# EAGLE design FAL65816_Videoa (EAGLE 8.7.1)
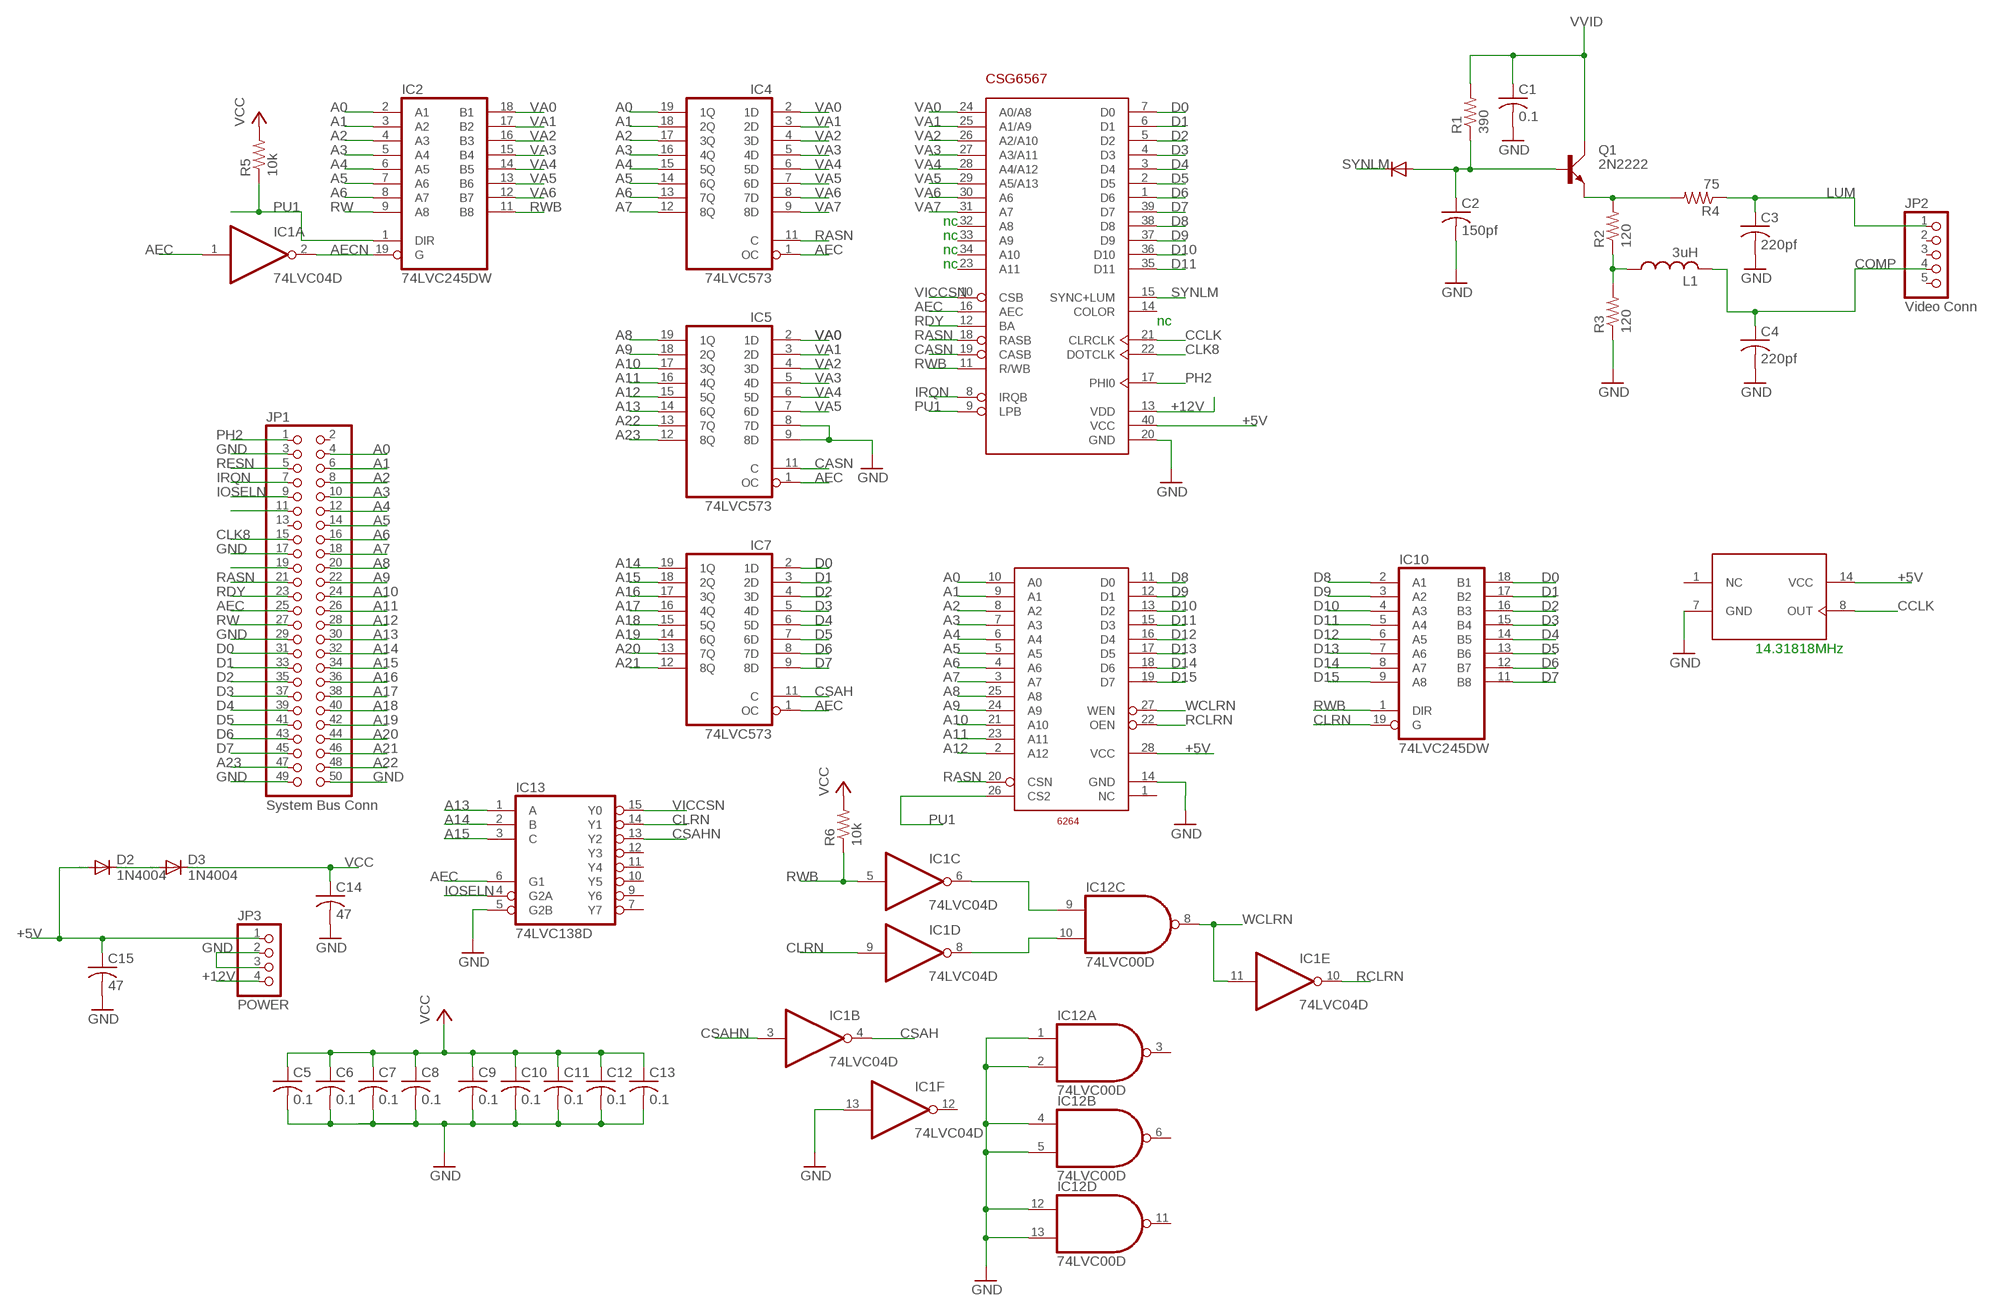
[diagram p0: schematic, sheet 1]

## Parts
C1  0.1  C-US050-024X044  [C050-024X044]
C2  150pf  C-US050-024X044  [C050-024X044]
C3  220pf  C-US050-024X044  [C050-024X044]
C4  220pf  C-US050-024X044  [C050-024X044]
C5  0.1  C-US050-024X044  [C050-024X044]
C6  0.1  C-US050-024X044  [C050-024X044]
C7  0.1  C-US050-024X044  [C050-024X044]
C8  0.1  C-US050-024X044  [C050-024X044]
C9  0.1  C-US050-024X044  [C050-024X044]
C10  0.1  C-US050-024X044  [C050-024X044]
C11  0.1  C-US050-024X044  [C050-024X044]
C12  0.1  C-US050-024X044  [C050-024X044]
C13  0.1  C-US050-024X044  [C050-024X044]
C14  47  C-US050-024X044  [C050-024X044]
C15  47  C-US050-024X044  [C050-024X044]
D2  1N4004  [DO41-10]
D3  1N4004  [DO41-10]
IC1  74LVC04D  74LS04D  [SO14]
IC2  74LVC245DW  74LS245DW  [SO20W]
IC4  74LVC573  [SO20W]
IC5  74LVC573  [SO20W]
IC7  74LVC573  [SO20W]
IC10  74LVC245DW  74LS245DW  [SO20W]
IC12  74LVC00D  74LS00D  [SO14]
IC13  74LVC138D  74LS138D  [SO16]
JP1  System Bus Conn  PINHD-2X25/90  [2X25/90]
JP2  Video Conn  PINHD-1X5  [1X05]
JP3  POWER  PINHD-1X4/90  [1X04/90]
L1  3uH  L-US0204/7  [0204/7]
Q1  2N2222  [TO18A]
R1  390  R-US_0204/7  [0204/7]
R2  120  R-US_0204/7  [0204/7]
R3  120  R-US_0204/7  [0204/7]
R4  75  R-US_0204/7  [0204/7]
R5  10k  R-US_0204/7  [0204/7]
R6  10k  R-US_0204/7  [0204/7]
U$1  CSG6567  [DIP-40]
U$3  OSC14  [DIL14]
U$4  6264  [DIL28-6]

## Nets
+5V: C15.1 D2.A JP3.1 U$1.40(VCC) U$3.14(VCC) U$4.28(VCC)
+12V: JP3.4 U$1.13(VDD)
A0: IC2.2(A1) IC4.19(1Q) JP1.4 U$4.10(A0)
A1: IC2.3(A2) IC4.18(2Q) JP1.6 U$4.9(A1)
A2: IC2.4(A3) IC4.17(3Q) JP1.8 U$4.8(A2)
A3: IC2.5(A4) IC4.16(4Q) JP1.10 U$4.7(A3)
A4: IC2.6(A5) IC4.15(5Q) JP1.12 U$4.6(A4)
A5: IC2.7(A6) IC4.14(6Q) JP1.14 U$4.5(A5)
A6: IC2.8(A7) IC4.13(7Q) JP1.16 U$4.4(A6)
A7: IC4.12(8Q) JP1.18 U$4.3(A7)
A8: IC5.19(1Q) JP1.20 U$4.25(A8)
A9: IC5.18(2Q) JP1.22 U$4.24(A9)
A10: IC5.17(3Q) JP1.24 U$4.21(A10)
A11: IC5.16(4Q) JP1.26 U$4.23(A11)
A12: IC5.15(5Q) JP1.28 U$4.2(A12)
A13: IC5.14(6Q) IC13.1(A) JP1.30
A14: IC7.19(1Q) IC13.2(B) JP1.32
A15: IC7.18(2Q) IC13.3(C) JP1.34
A16: IC7.17(3Q) JP1.36
A17: IC7.16(4Q) JP1.38
A18: IC7.15(5Q) JP1.40
A19: IC7.14(6Q) JP1.42
A20: IC7.13(7Q) JP1.44
A21: IC7.12(8Q) JP1.46
A22: IC5.13(7Q) JP1.48
A23: IC5.12(8Q) JP1.47
AEC: IC1.1(A:I) IC4.1(OC) IC5.1(OC) IC7.1(OC) IC13.6(G1) JP1.25 U$1.16(AEC)
AECN: IC1.2(A:O) IC2.19(G)
CASN: IC5.11(C) U$1.19(CASB)
CCLK: U$1.21(CLRCLK) U$3.8(OUT)
CLK8: JP1.15 U$1.22(DOTCLK)
CLRN: IC1.9(D:I) IC10.19(G) IC13.14(Y1)
COMP: C4.1 JP2.4 L1.2
CSAH: IC1.4(B:O) IC7.11(C)
CSAHN: IC1.3(B:I) IC13.13(Y2)
D0: IC7.2(1D) IC10.18(B1) JP1.31 U$1.7(D0)
D1: IC7.3(2D) IC10.17(B2) JP1.33 U$1.6(D1)
D2: IC7.4(3D) IC10.16(B3) JP1.35 U$1.5(D2)
D3: IC7.5(4D) IC10.15(B4) JP1.37 U$1.4(D3)
D4: IC7.6(5D) IC10.14(B5) JP1.39 U$1.3(D4)
D5: IC7.7(6D) IC10.13(B6) JP1.41 U$1.2(D5)
D6: IC7.8(7D) IC10.12(B7) JP1.43 U$1.1(D6)
D7: IC7.9(8D) IC10.11(B8) JP1.45 U$1.39(D7)
D8: IC10.2(A1) U$1.38(D8) U$4.11(D0)
D9: IC10.3(A2) U$1.37(D9) U$4.12(D1)
D10: IC10.4(A3) U$1.36(D10) U$4.13(D2)
D11: IC10.5(A4) U$1.35(D11) U$4.15(D3)
D12: IC10.6(A5) U$4.16(D4)
D13: IC10.7(A6) U$4.17(D5)
D14: IC10.8(A7) U$4.18(D6)
D15: IC10.9(A8) U$4.19(D7)
GND: C1.2 C2.2 C3.2 C4.2 C5.2 C6.2 C7.2 C8.2 C9.2 C10.2 C11.2 C12.2 C13.2 C14.2 C15.2 IC1.13(F:I) IC5.8(7D) IC5.9(8D) IC12.1(A:I0) IC12.2(A:I1) IC12.4(B:I0) IC12.5(B:I1) IC12.12(D:I0) IC12.13(D:I1) IC13.5(G2B) JP1.3 JP1.17 JP1.29 JP1.49 JP1.50 JP3.2 JP3.3 R3.1 U$1.20(GND) U$3.7(GND) U$4.14(GND)
IOSELN: IC13.4(G2A) JP1.9
IRQN: JP1.7 U$1.8(IRQB)
LUM: C3.1 JP2.1 R4.1
N$2: D2.C D3.A
N$5: IC1.6(C:O) IC12.9(C:I0)
N$6: IC1.8(D:O) IC12.10(C:I1)
N$10: JP1.19
N$15: C2.1 Q1.B R1.1
N$17: L1.1 R2.1 R3.2
N$18: Q1.E R2.2 R4.2
N$40: JP1.11
PH2: JP1.1 U$1.17(PHI0)
PU1: IC2.1(DIR) R5.1 U$1.9(LPB) U$4.26(CS2)
RASN: IC4.11(C) JP1.21 U$1.18(RASB) U$4.20(CSN)
RCLRN: IC1.10(E:O) U$4.22(OEN)
RDY: JP1.23 U$1.12(BA)
RESN: JP1.5
RW: IC2.9(A8) JP1.27
RWB: IC1.5(C:I) IC2.11(B8) IC10.1(DIR) R6.1 U$1.11(R/WB)
SYNLM: U$1.15(SYNC+LUM)
VA0: IC2.18(B1) IC4.2(1D) IC5.2(1D) U$1.24(A0/A8)
VA1: IC2.17(B2) IC4.3(2D) IC5.3(2D) U$1.25(A1/A9)
VA2: IC2.16(B3) IC4.4(3D) IC5.4(3D) U$1.26(A2/A10)
VA3: IC2.15(B4) IC4.5(4D) IC5.5(4D) U$1.27(A3/A11)
VA4: IC2.14(B5) IC4.6(5D) IC5.6(5D) U$1.28(A4/A12)
VA5: IC2.13(B6) IC4.7(6D) IC5.7(6D) U$1.29(A5/A13)
VA6: IC2.12(B7) IC4.8(7D) U$1.30(A6)
VA7: IC4.9(8D) U$1.31(A7)
VCC: C5.1 C6.1 C7.1 C8.1 C9.1 C10.1 C11.1 C12.1 C13.1 C14.1 D3.C R5.2 R6.2
VICCSN: IC13.15(Y0) U$1.10(CSB)
VVID: C1.1 Q1.C R1.2
WCLRN: IC1.11(E:I) IC12.8(C:O) U$4.27(WEN)
Unconnected: IC1.12(F:O) IC12.3(A:O) IC12.6(B:O) IC12.11(D:O) IC13.7(Y7) IC13.9(Y6) IC13.10(Y5) IC13.11(Y4) IC13.12(Y3) JP1.2 JP1.13 JP2.2 JP2.3 JP2.5 U$1.14(COLOR) U$1.23(A11) U$1.32(A8) U$1.33(A9) U$1.34(A10) U$3.1(NC) U$4.1(NC)

## Notes on the sheet
- nc
- nc
- nc
- nc
- nc
- 14.31818MHz

## Power pins joined to a net without a drawn wire
GND: IC1.7(P:GND) IC2.10(GND) IC4.10(GND) IC5.10(GND) IC7.10(GND) IC10.10(GND) IC12.7(P:GND) IC13.8(GND)
VCC: IC1.14(P:VCC) IC2.20(VCC) IC4.20(VCC) IC5.20(VCC) IC7.20(VCC) IC10.20(VCC) IC12.14(P:VCC) IC13.16(VCC)

## Library data of the parts
C1 C3 C4 = resistor:C-US: CAPACITOR, American symbol
C2 C5-C15 = rcl:C-US: CAPACITOR, American symbol
D2 D3 = diode:1N4004: DIODE general purpose rectifier, 1 A
IC1 = 74xx-us:74*04: Hex INVERTER
IC2 = FT74xx:74*245: Octal BUS TRANSCEIVER, 3-state
IC4 IC5 IC7 = FT74xx:74*573: 8-bit D latch BUS DRIVER
IC10 = 74xx-us:74*245: Octal BUS TRANSCEIVER, 3-state
IC12 = 74xx-us:74*00: Quad 2-input NAND gate
IC13 = FT74xx:74*138: 3-line to 8-line DECODER/DEMULTIPLEXER
JP1 = pinhead:PINHD-2X25: PIN HEADER
JP2 = pinhead:PINHD-1X5: PIN HEADER
JP3 = pinhead:PINHD-1X4: PIN HEADER
L1 = resistor:L-US: INDUCTOR, American symbol
Q1 = transistor-small-signal:2N2222: NPN TRANSISTOR
R1-R6 = resistor:R-US_: RESISTOR, American symbol
U$1 = 65xxx:CSG6567
U$3 = FT74xx:OSC14
U$4 = FT74xx:6264: 8kx8 Static RAM

## Board
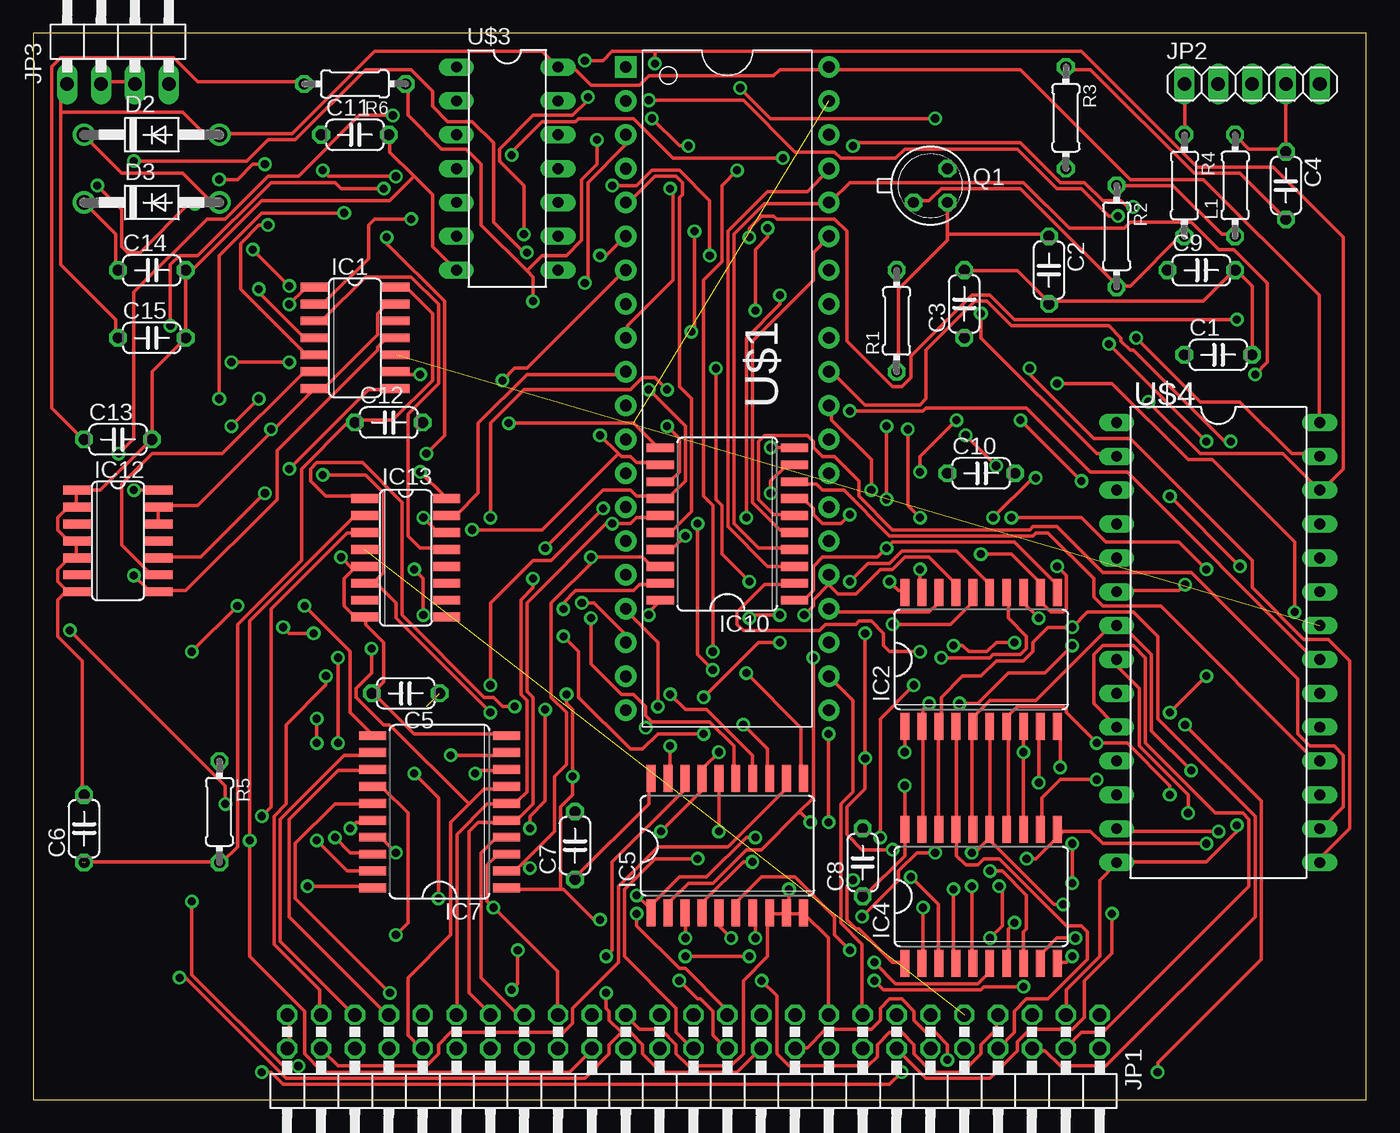
[diagram p1: board, top side]
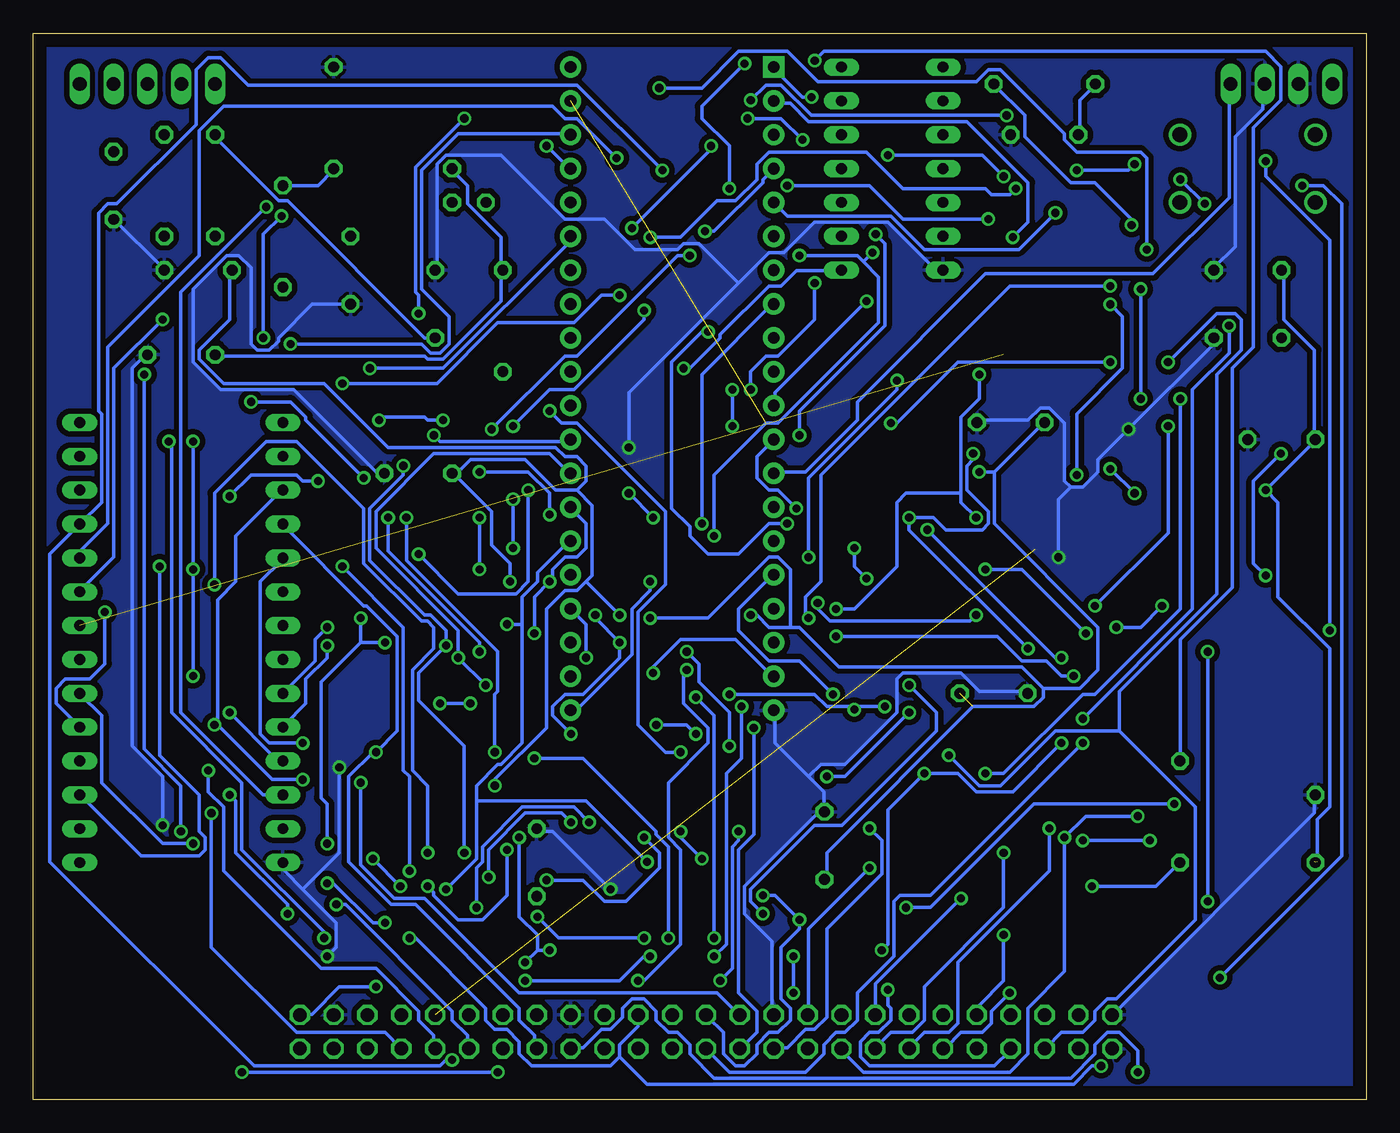
[diagram p2: board, bottom side, seen from below]

Size 100 x 80 mm. Coordinates in mm from the lower left corner, seen from the top.
Outline: 0,0 100,0 100,80 0,80 0,0
Copper layers (1*16): Top 0.035mm / dielectric 1.5mm / Bottom 0.035mm
Design rules "default": minimum track width 10mil, minimum drill 24mil, track to track 8mil, track to pad 8mil, pad to pad 8mil, via to via 8mil, smd to smd 8mil, copper to edge 40mil, drill to drill 8mil, minimum pad ring 10mil, minimum via ring 8mil, stop-mask expansion 4mil, vias tented up to drill 0mil, thermal gap 10mil

### Footprints (pad centres in the part's own frame; a part is rotated, then mirrored left to right if it is on the bottom)
C050-024X044 = drill 0.813 octagon: 1 -2.54,0; 2 2.54,0
DO41-10 = drill 1.118: A 5.08,0; C -5.08,0
SO14 = smd 0.66 x 2.032: 1 -3.81,-3.073; 2 -2.54,-3.073; 3 -1.27,-3.073; 4 0,-3.073; 5 1.27,-3.073; 6 2.54,-3.073; 7 3.81,-3.073; 8 3.81,3.073; 9 2.54,3.073; 10 1.27,3.073; 11 0,3.073; 12 -1.27,3.073; 13 -2.54,3.073; 14 -3.81,3.073
SO20W = smd 0.66 x 2.032: 1 -5.715,-5.029; 2 -4.445,-5.029; 3 -3.175,-5.029; 4 -1.905,-5.029; 5 -0.635,-5.029; 6 0.635,-5.029; 7 1.905,-5.029; 8 3.175,-5.029; 9 4.445,-5.029; 10 5.715,-5.029; 11 5.715,5.029; 12 4.445,5.029; 13 3.175,5.029; 14 1.905,5.029; 15 0.635,5.029; 16 -0.635,5.029; 17 -1.905,5.029; 18 -3.175,5.029; 19 -4.445,5.029; 20 -5.715,5.029
SO16 = smd 0.66 x 2.032: 1 -4.445,-3.073; 2 -3.175,-3.073; 3 -1.905,-3.073; 4 -0.635,-3.073; 5 0.635,-3.073; 6 1.905,-3.073; 7 3.175,-3.073; 8 4.445,-3.073; 9 4.445,3.073; 10 3.175,3.073; 11 1.905,3.073; 12 0.635,3.073; 13 -0.635,3.073; 14 -1.905,3.073; 15 -3.175,3.073; 16 -4.445,3.073
2X25/90 = drill 1.016 octagon: 1 -29.21,-6.35; 2 -29.21,-3.81; 3 -26.67,-6.35; 4 -26.67,-3.81; 5 -24.13,-6.35; 6 -24.13,-3.81; 7 -21.59,-6.35; 8 -21.59,-3.81; 9 -19.05,-6.35; 10 -19.05,-3.81; 11 -16.51,-6.35; 12 -16.51,-3.81; 13 -13.97,-6.35; 14 -13.97,-3.81; 15 -11.43,-6.35; 16 -11.43,-3.81; 17 -8.89,-6.35; 18 -8.89,-3.81; 19 -6.35,-6.35; 20 -6.35,-3.81; 21 -3.81,-6.35; 22 -3.81,-3.81; 23 -1.27,-6.35; 24 -1.27,-3.81; 25 1.27,-6.35; 26 1.27,-3.81; 27 3.81,-6.35; 28 3.81,-3.81; 29 6.35,-6.35; 30 6.35,-3.81; 31 8.89,-6.35; 32 8.89,-3.81; 33 11.43,-6.35; 34 11.43,-3.81; 35 13.97,-6.35; 36 13.97,-3.81; 37 16.51,-6.35; 38 16.51,-3.81; 39 19.05,-6.35; 40 19.05,-3.81; 41 21.59,-3.81; 42 21.59,-6.35; 43 24.13,-3.81; 44 24.13,-6.35; 45 26.67,-3.81; 46 26.67,-6.35; 47 29.21,-3.81; 48 29.21,-6.35; 49 31.75,-3.81; 50 31.75,-6.35
1X05 = drill 1.016 long: 1 -5.08,0; 2 -2.54,0; 3 0,0; 4 2.54,0; 5 5.08,0
1X04/90 = drill 1.016 long: 1 -3.81,-3.81; 2 -1.27,-3.81; 3 1.27,-3.81; 4 3.81,-3.81
0204/7 = drill 0.813 octagon: 1 -3.81,0; 2 3.81,0
TO18A = drill 0.813 octagon: B 1.27,-1.27; C 1.27,1.27; E -1.27,-1.27
DIP-40 = drill 0.889 pad 1.6 square: 1 -22.86,-7.62 | drill 0.889 pad 1.6: 2 -20.32,-7.62; 3 -17.78,-7.62; 4 -15.24,-7.62; 5 -12.7,-7.62; 6 -10.16,-7.62; 7 -7.62,-7.62; 8 -5.08,-7.62; 9 -2.54,-7.62; 10 0,-7.62; 11 2.54,-7.62; 12 5.08,-7.62; 13 7.62,-7.62; 14 10.16,-7.62; 15 12.7,-7.62; 16 15.24,-7.62; 17 17.78,-7.62; 18 20.32,-7.62; 19 22.86,-7.62; 20 25.4,-7.62; 21 25.4,7.62; 22 22.86,7.62; 23 20.32,7.62; 24 17.78,7.62; 25 15.24,7.62; 26 12.7,7.62; 27 10.16,7.62; 28 7.62,7.62; 29 5.08,7.62; 30 2.54,7.62; 31 0,7.62; 32 -2.54,7.62; 33 -5.08,7.62; 34 -7.62,7.62; 35 -10.16,7.62; 36 -12.7,7.62; 37 -15.24,7.62; 38 -17.78,7.62; 39 -20.32,7.62; 40 -22.86,7.62
DIL14 = drill 0.813 long: 1 -7.62,-3.81; 2 -5.08,-3.81; 3 -2.54,-3.81; 4 0,-3.81; 5 2.54,-3.81; 6 5.08,-3.81; 7 7.62,-3.81; 8 7.62,3.81; 9 5.08,3.81; 10 2.54,3.81; 11 0,3.81; 12 -2.54,3.81; 13 -5.08,3.81; 14 -7.62,3.81
DIL28-6 = drill 0.813 long: 1 -16.51,-7.62; 2 -13.97,-7.62; 3 -11.43,-7.62; 4 -8.89,-7.62; 5 -6.35,-7.62; 6 -3.81,-7.62; 7 -1.27,-7.62; 8 1.27,-7.62; 9 3.81,-7.62; 10 6.35,-7.62; 11 8.89,-7.62; 12 11.43,-7.62; 13 13.97,-7.62; 14 16.51,-7.62; 15 16.51,7.62; 16 13.97,7.62; 17 11.43,7.62; 18 8.89,7.62; 19 6.35,7.62; 20 3.81,7.62; 21 1.27,7.62; 22 -1.27,7.62; 23 -3.81,7.62; 24 -6.35,7.62; 25 -8.89,7.62; 26 -11.43,7.62; 27 -13.97,7.62; 28 -16.51,7.62

### Placement (x,y rotation side)
C1  88.9,55.88 0 top
C2  76.2,62.23 270 top
C3  69.85,59.69 90 top
C4  93.98,68.58 270 top
C5  27.94,30.48 180 top
C6  3.81,20.32 90 top
C7  40.64,19.05 90 top
C8  62.23,17.78 90 top
C9  87.63,62.23 0 top
C10  71.12,46.99 0 top
C11  24.13,72.39 0 top
C12  26.67,50.8 0 top
C13  6.35,49.53 0 top
C14  8.89,62.23 0 top
C15  8.89,57.15 0 top
D2  8.89,72.39 0 top
D3  8.89,67.31 0 top
IC1  24.13,57.15 270 top
IC2  71.12,33.02 0 top
IC4  71.12,15.24 0 top
IC5  52.07,19.05 0 top
IC7  30.48,21.59 90 top
IC10  52.07,43.18 90 top
IC12  6.35,41.91 270 top
IC13  27.94,40.64 270 top
JP1  50.8,0 180 top
JP2  91.44,76.2 0 top
JP3  6.35,80.01 0 top
L1  90.17,68.58 90 top
Q1  67.31,68.58 0 top
R1  64.77,58.42 90 top
R2  81.28,64.77 270 top
R3  77.47,73.66 270 top
R4  86.36,68.58 270 top
R5  13.97,21.59 270 top
R6  24.13,76.2 180 top
U$1  52.07,54.61 270 top
U$3  35.56,69.85 270 top
U$4  88.9,34.29 270 top

### Tracks (layer width: path | path; a pad name or v marks a point on that pad's centre or on a via)
+5V
  Top 0.254: 2.06,74.07 2.06,75.67 2.52,76.12 JP3.1 | 2.06,74.07 2.06,62.64 6.17,58.52 6.17,57.15 C15.1 | 2.06,74.07 11.2,74.07 12.8,72.47 13.95,72.47 D2.A 14.17,72.47 19.43,72.47 25.6,78.64 38.18,78.64 39.32,77.5 U$3.14 39.55,77.27 40.69,77.27 41.83,76.12 45.49,76.12 46.18,76.81 55.55,76.81 56.01,77.27 59.66,77.27 U$1.40 59.89,77.27 74.07,77.27 82.3,69.04 87.78,69.04 96.47,60.35 96.47,50.98 U$4.28
+12V
  Bottom 0.254: JP3.4 10.29,76.12 10.29,67.67 16,61.95 28.57,61.95 38.18,52.35 38.18,50.98 42.06,47.09 44.35,47.09 U$1.13
A0  (via drill 0.61)
  Top 0.254: IC4.19 66.75,20.34 66.75,27.89 IC2.2 66.75,28.12 66.75,29.26 v67.21,29.72 | U$4.10 81.15,28.12 79.55,29.72 79.55,33.38 80.24,34.06 82.53,34.06 83.44,33.15 83.44,26.75 88.7,21.49 90.75,21.49 91.21,21.03 91.21,16 80.24,5.03 78.64,5.03 77.5,3.89 JP1.4 | v69.49,29.72 70.87,29.72 73.15,32 75.89,32 v77.95,34.06
  Bottom 0.254: v69.49,29.72 v67.21,29.72 | v77.95,34.06 77.95,33.15 79.55,31.55 79.55,29.72 81.15,28.12 U$4.10
A1  (via drill 0.61)
  Top 0.254: IC4.18 67.89,20.34 67.89,27.89 IC2.3 68.12,28.12 68.12,30.18 69.72,31.77 71.09,31.77 72.24,32.92 74.3,32.92 74.98,33.6 74.98,34.29 76.12,35.43 v77.95,35.43 79.1,36.58 82.53,36.58 84.35,34.75 84.35,28.57 91.67,21.26 91.67,13.72 80.47,2.52 77.04,2.52 75.89,3.66 74.98,3.66 JP1.6
  Bottom 0.254: v77.95,35.43 78.87,34.52 78.87,32.92 81.15,30.63 U$4.9
A2  (via drill 0.61)
  Top 0.254: IC2.4 69.27,27.89 69.27,20.34 IC4.17 69.27,20.12 69.27,18.29 69.95,17.6 70.87,17.6 71.32,18.06 72.47,18.06 77.5,13.03 78.64,13.03 79.1,12.57 79.1,10.52 76.12,7.54 74.52,7.54 73.61,6.63 73.61,5.03 JP1.8 | v86.64,21.49 86.64,22.86 82.98,26.52 82.98,30.86 81.38,32.46 81.38,32.92 U$4.8
  Bottom 0.254: v86.64,21.49 86.64,11.43 80.24,5.03 73.61,5.03 JP1.8
A3  (via drill 0.61)
  Top 0.254: IC4.16 70.41,20.34 70.41,27.89 IC2.5 70.64,28.12 70.64,28.8 71.78,29.95 75.21,29.95 80.7,35.43 81.15,35.43 U$4.7 81.38,35.43 81.84,35.43 83.9,33.38 83.9,27.66 v86.87,24.69
  Bottom 0.254: v86.87,24.69 86.87,23.09 85.72,21.95 85.72,17.14 78.41,9.83 74.3,9.83 71.09,6.63 71.09,5.94 69.95,4.8 69.95,3.89 JP1.10
A4  (via drill 0.61)
  Top 0.254: IC4.15 71.78,20.34 71.78,27.89 IC2.6 | v86.41,38.63 85.95,38.18 81.38,38.18 U$4.6 | v70.41,18.52 70.64,18.52 71.55,19.43 71.55,19.66 | 71.55,19.66 71.55,20.12 IC4.15 | v77.27,14.63 76.58,14.63 71.55,19.66 | 71.55,19.66 IC4.15
  Bottom 0.254: v86.41,38.63 86.41,45.49 82.53,49.38 80.24,49.38 75.21,44.35 75.21,40.23 70.87,35.89 70.41,35.89 69.95,35.43 69.95,33.83 71.55,32.23 71.55,24.69 70.41,23.55 v70.41,18.52 | v77.27,14.63 76.58,14.63 68.58,6.63 68.58,5.94 67.44,4.8 67.44,3.89 JP1.12
A5  (via drill 0.61)
  Top 0.254: IC4.14 73.15,20.34 73.15,27.89 IC2.7 73.15,28.12 73.15,28.8 73.84,29.49 77.27,29.49 77.5,29.26 77.5,29.03 v79.78,26.75 82.07,26.75 85.27,23.55 v85.27,22.86 | JP1.14 66.98,1.6 71.78,1.6 73.84,3.66 73.84,4.34 74.75,5.26 77.95,5.26 78.87,6.17 78.87,8.91 80.92,10.97 v80.92,13.95
  Bottom 0.254: v79.78,26.75 82.3,26.75 82.98,27.43 82.98,38.86 81.38,40.46 U$4.5 | v80.92,13.95 80.92,14.63 84.81,18.52 84.81,22.4 v85.27,22.86
A6  (via drill 0.61)
  Top 0.254: IC2.8 v74.3,26.06 IC4.13
  Bottom 0.254: U$4.4 81.15,42.98 75.21,37.03 74.98,37.03 72.69,34.75 72.69,27.66 v74.3,26.06 74.52,26.06 76.35,24.23 76.35,17.83 73.15,14.63 71.32,14.63 63.55,6.86 63.55,5.94 62.41,4.8 62.41,3.89 JP1.16
A7  (via drill 0.61)
  Top 0.254: v79.78,24 77.04,24 75.67,22.63 75.67,20.34 IC4.12 | v17.14,2.06 17.83,2.06 18.75,1.14 64.24,1.14 v65.15,2.06 | v84.35,2.06 84.35,2.74 92.13,10.52 92.13,22.4 v86.41,28.12
  Bottom 0.254: v79.78,24 82.07,24 86.18,28.12 | 86.18,28.12 86.18,37.49 84.81,38.86 84.81,42.29 81.38,45.72 U$4.3 | v17.14,2.06 17.14,3.66 18.52,5.03 19.43,5.03 20.34,4.12 20.34,3.43 22.17,1.6 48.92,1.6 50.75,3.43 50.75,4.12 51.66,5.03 52.35,5.03 53.26,5.94 53.26,6.63 54.18,7.54 55.09,7.54 55.78,6.86 55.78,6.17 56.69,5.26 57.38,5.26 58.75,3.89 59.66,3.89 JP1.18 | v84.35,2.06 v65.15,2.06 | 86.18,28.12 v86.41,28.12
A8  (via drill 0.61)
  Top 0.254: v47.78,26.52 47.78,24.23 IC5.19 | v50.98,33.6 50.98,44.58 50.29,45.26 50.29,61.49 51.66,62.87 51.66,68.58 v52.81,69.72 | v68.58,2.97 68.58,4.12 67.67,5.03 66.98,5.03 66.06,5.94 66.06,6.63 65.15,7.54 64.24,7.54 63.55,6.86 63.55,5.94 62.87,5.26 59.44,5.26 58.06,3.89 57.15,3.89 JP1.20
  Bottom 0.254: v47.78,26.52 47.78,29.03 50.06,31.32 50.06,32.69 v50.98,33.6 | v52.81,69.72 59.21,76.12 83.9,76.12 85.95,78.18 86.87,78.18 87.78,77.27 87.78,73.15 93.73,67.21 94.41,67.21 95.1,66.52 95.1,51.66 94.87,51.44 94.87,44.81 96.47,43.2 U$4.25 96.7,42.98 98.75,40.92 98.75,17.83 83.44,2.52 69.49,2.52 69.04,2.97 v68.58,2.97
A9  (via drill 0.61)
  Top 0.254: v42.98,10.74 43.43,11.2 43.43,17.83 48.69,23.09 48.69,24 IC5.18 | v42.98,8 42.98,6.86 43.2,6.63 43.2,5.94 44.12,5.03 | 44.12,5.03 44.81,5.03 45.72,4.12 45.72,3.43 47.09,2.06 52.81,2.06 54.41,3.66 JP1.22 | v56.24,70.64 48.01,70.64 45.03,73.61 40.92,73.61 40.69,73.38 38.18,73.38 35.89,71.09 v35.89,70.87 | v27.2,69.27 22.17,69.27 v21.72,69.72 | v17.37,70.18 16.46,70.18 15.32,69.04 v13.95,69.04 | v12.12,67.21 11.66,67.21 8,63.55 7.09,63.55 6.63,64.01 6.63,66.75 v4.8,68.58 | v10.97,9.14 11.43,9.14 18.97,1.6 41.38,1.6 43.2,3.43 43.2,4.12 44.12,5.03
  Bottom 0.254: v42.98,8 v42.98,10.74 | v56.24,70.64 59.21,73.61 60.12,73.61 61.04,74.52 85.72,74.52 87.55,72.69 87.55,63.32 94.41,56.46 94.41,43.2 96.47,41.15 96.47,40.69 U$4.24 | v35.89,70.87 28.8,70.87 v27.2,69.27 | v21.72,69.72 17.83,69.72 v17.37,70.18 | v12.12,67.21 v13.95,69.04 | v4.8,68.58 3.2,68.58 1.83,67.21 1.83,18.29 v10.97,9.14
A10  (via drill 0.61)
  Top 0.254: v47.09,20.12 50.06,23.09 50.06,24 IC5.17 50.29,24.23 50.29,24.92 v51.44,26.06 | v48.46,8.91 49.84,7.54 50.06,7.54 50.98,6.63 50.98,4.8 51.89,3.89 JP1.24 | v61.27,51.66 66.75,51.66 66.98,51.89 74.52,51.89 79.32,47.09 82.07,47.09 96.01,33.15 96.47,33.15 U$4.21
  Bottom 0.254: v47.09,20.12 47.09,19.43 47.55,18.97 47.55,9.83 v48.46,8.91 | v61.27,51.66 60.35,50.75 59.21,50.75 52.58,44.12 52.58,38.63 54.63,36.58 54.63,28.12 52.58,26.06 v51.44,26.06
A11  (via drill 0.61)
  Top 0.254: v51.44,20.12 IC5.16 | v49.84,18.06 46.63,18.06 44.35,15.77 44.35,10.74 48.23,6.86 48.23,5.03 49.38,3.89 JP1.26 | v90.3,58.52 73.61,58.52 71.78,60.35 70.41,60.35 65.84,55.78 65.84,54.18 65.15,53.49 64.47,53.49 61.04,56.92 61.04,65.15 60.12,66.06 55.78,66.06 55.55,66.29 54.63,66.29 53.72,65.38 v53.72,64.69 | v26.29,68.35 23.09,68.35 22.63,68.81 17.83,68.81 12.34,63.32 10.97,63.32 10.29,62.64 v10.29,58.06 | v21.26,26.75 v21.26,28.57
  Bottom 0.254: v51.44,20.12 51.44,19.66 v49.84,18.06 | v90.3,58.52 93.95,54.86 93.95,40.69 96.47,38.18 U$4.23 | v53.72,64.69 51.44,64.69 48.69,67.44 47.32,67.44 45.72,69.04 45.72,70.18 44.81,71.09 37.49,71.09 34.75,68.35 28.57,68.35 28.12,67.89 26.75,67.89 v26.29,68.35 | v10.29,58.06 10.29,56.01 13.03,53.26 13.03,36.8 v21.26,28.57 | v21.26,26.75 32.69,15.32 34.98,15.32 35.43,14.86 35.43,10.74 38.18,8 38.18,5.94 39.09,5.03 39.78,5.03 40.69,4.12 40.69,3.43 42.06,2.06 47.78,2.06 JP1.26
A12  (via drill 0.61)
  Top 0.254: 46.41,28.35 50.75,28.35 52.58,26.52 52.58,24.23 IC5.15 | v45.95,27.89 46.41,28.35 | v71.09,58.98 71.09,57.15 79.78,48.46 81.15,48.46 U$4.2 | v67.67,73.61 55.32,73.61 v53.03,75.89 | v19.2,61.04 v16.46,63.78 | v41.83,36.12 41.83,32.69 44.12,30.4 45.03,30.4 45.95,29.49 45.95,28.8 46.41,28.35
  Bottom 0.254: v45.95,27.89 45.95,19.89 47.09,18.75 47.09,8 45.72,6.63 45.72,5.03 46.86,3.89 JP1.28 | v71.09,58.98 71.09,60.35 71.32,60.58 71.32,69.95 v67.67,73.61 | v53.03,75.89 49.84,75.89 47.09,78.64 43.43,78.64 41.15,76.35 29.26,76.35 28.35,77.27 27.43,77.27 22.63,72.47 22.63,72.01 21.72,71.09 16.92,71.09 16.46,70.64 v16.46,63.78 | v19.2,61.04 26.75,61.04 40.92,46.86 40.92,38.86 42.06,37.72 42.06,36.35 v41.83,36.12
A13  (via drill 0.61)
  Top 0.254: v47.78,30.4 48.92,29.26 50.52,29.26 53.95,25.83 53.95,24.23 IC5.14 | v36.12,29.49 35.2,29.49 34.52,30.18 33.83,30.18 27.66,36.35 27.66,44.81 24.69,47.78 21.26,47.78 20.8,47.32 20.8,46.41 21.95,45.26 24.69,45.26 IC13.1 | v37.26,20.34 37.26,21.26 38.41,22.4 v38.41,29.26
  Bottom 0.254: v47.78,30.4 41.38,30.4 40.46,29.49 38.41,29.49 | v36.12,29.49 38.41,29.49 | v37.26,20.34 36.35,19.43 36.35,16.92 40.46,12.8 40.46,6.17 41.38,5.26 42.06,5.26 43.43,3.89 44.35,3.89 JP1.30 | 38.41,29.49 v38.41,29.26
A14  (via drill 0.61)
  Top 0.254: IC13.2 24.69,43.66 24,43.66 16.23,35.89 v16.23,19.43 16.23,10.74 20.34,6.63 20.34,3.43 21.72,2.06 40.23,2.06 41.83,3.66 JP1.32 | IC7.19 23.55,17.14 v21.26,19.43
  Bottom 0.254: v16.23,19.43 v21.26,19.43
A15  (via drill 0.61)
  Top 0.254: v22.63,19.66 23.77,18.52 25.38,18.52 IC7.18 | v17.14,21.26 17.83,21.95 17.83,36.8 23.55,42.52 24.69,42.52 IC13.3
  Bottom 0.254: JP1.34 39.32,3.66 37.72,2.06 26.75,2.06 25.38,3.43 25.38,6.86 22.63,9.6 v22.63,19.66 21.03,21.26 v17.14,21.26
A16  (via drill 0.61)
  Top 0.254: v27.2,18.52 26.06,19.66 25.6,19.66 IC7.17
  Bottom 0.254: v27.2,18.52 27.2,14.4 33.15,8.46 33.15,5.94 34.06,5.03 35.66,5.03 36.8,3.89 JP1.36
A17  (via drill 0.61)
  Top 0.254: v23.77,20.34 24.23,20.8 25.38,20.8 IC7.16
  Bottom 0.254: v23.77,20.34 23.77,17.14 30.63,10.29 30.63,5.71 31.32,5.03 33.15,5.03 34.29,3.89 JP1.38
A18  (via drill 0.61)
  Top 0.254: v26.75,8 19.66,15.09 19.66,19.2 22.63,22.17 25.38,22.17 IC7.15
  Bottom 0.254: v26.75,8 28.12,6.63 28.12,5.71 28.8,5.03 30.4,5.03 31.55,3.89 JP1.40
A19  (via drill 0.61)
  Top 0.254: v27.2,12.34 28.12,13.26 28.12,21.49 26.29,23.32 25.6,23.32 IC7.14
  Bottom 0.254: v27.2,12.34 27.2,8.91 29.03,7.09 29.03,6.4 JP1.42
A20
  Top 0.254: IC7.13 25.38,24.69 22.86,24.69 19.2,21.03 19.2,13.72 26.52,6.4 JP1.44
A21
  Top 0.254: IC7.12 25.38,25.83 23.32,25.83 18.52,21.03 18.52,11.89 24,6.4 JP1.46
A22  (via drill 0.61)
  Top 0.254: v53.26,28.12 55.09,26.29 55.09,24.23 IC5.13 | v50.29,27.43 46.86,27.43 45.72,26.29 44.81,26.29 40.92,30.18 40.92,33.6 v39.78,34.75 | v21.95,31.77 21.95,31.09 18.97,28.12 18.97,22.17 18.06,21.26 18.06,11.66 21.49,8.23 21.49,6.4 JP1.48
  Bottom 0.254: v53.26,28.12 50.98,28.12 v50.29,27.43 | v39.78,34.75 27.66,34.75 25.83,32.92 24,32.92 22.86,31.77 v21.95,31.77
A23
  Top 0.254: IC5.12 56.46,24 56.46,23.32 52.12,18.97 46.86,18.97 43.89,16 43.89,10.29 40.46,6.86 40.46,5.71 39.78,5.03 31.32,5.03 30.4,4.12 30.4,3.43 29.49,2.52 22.86,2.52 21.72,3.66 JP1.47
AEC  (via drill 0.61)
  Top 0.254: 25.6,38.86 24.92,38.86 IC13.6 25.6,38.86 | 25.6,38.86 26.29,39.55 26.29,45.49 24.92,46.86 v21.72,46.86 | v19.2,59.66 20.34,60.81 21.03,60.81 IC1.1 | 39.55,15.77 39.78,15.77 42.06,13.49 v42.52,13.49 | 39.55,15.77 35.66,15.77 IC7.1 | 46.18,14.4 46.18,14.17 IC5.1 46.18,14.4 | v45.26,15.32 46.18,14.4 | v61.49,16.46 61.04,16 61.04,13.49 61.72,12.8 61.95,12.8 64.47,10.29 65.38,10.29 IC4.1 | v54.18,19.66 53.49,19.66 50.52,16.69 48.46,16.69 46.18,14.4 | v40.01,30.4 40.01,29.72 40.46,29.26 v40.46,24.23 40.46,22.86 39.55,21.95 39.55,15.77 | 25.6,38.86 27.2,37.26 27.2,36.12 v34.29,29.03
  Bottom 0.254: v21.72,46.86 21.72,51.44 18.29,54.86 18.29,58.75 v19.2,59.66 | JP1.25 49.38,6.17 48.23,5.03 48.23,3.43 47.32,2.52 46.63,2.52 45.72,3.43 45.72,4.12 44.81,5.03 44.12,5.03 43.2,5.94 43.2,6.86 43.89,7.54 43.89,11.43 42.52,12.8 v42.52,13.49 44.35,15.32 v45.26,15.32 | v61.49,16.46 58.75,16.46 57.15,14.86 55.55,14.86 53.03,17.37 53.03,18.52 v54.18,19.66 | v40.01,30.4 42.52,32.92 44.81,32.92 47.09,35.2 47.09,36.8 44.58,39.32 U$1.16 | v34.29,29.03 39.09,24.23 v40.46,24.23
AECN  (via drill 0.61)
  Top 0.254: v28.35,66.06 25.6,66.06 25.15,65.61 25.15,63.09 21.95,59.89 21.26,59.89 IC1.2 | v43.43,68.58 45.26,68.58 46.41,69.72 48.46,69.72 50.75,67.44 v50.75,63.32 | v65.61,50.29 65.61,44.58 v66.52,43.66 | v66.52,39.78 66.52,38.18 IC2.19
  Bottom 0.254: v28.35,66.06 34.75,66.06 37.26,68.58 v43.43,68.58 | v50.75,63.32 51.66,63.32 59.21,55.78 60.12,55.78 v65.61,50.29 | v66.52,39.78 v66.52,43.66
CASN  (via drill 0.61)
  Top 0.254: v53.49,32 57.61,27.89 57.61,24.23 IC5.11
  Bottom 0.254: v53.49,32 53.49,32.46 51.44,34.52 47.32,34.52 44.58,31.77 U$1.19
CCLK  (via drill 0.61)
  Top 0.254: v51.21,54.86 51.21,45.03 51.66,44.58 51.66,40.92 v53.72,38.86
  Bottom 0.254: v51.21,54.86 50.75,54.86 48.46,57.15 48.46,57.38 44.81,61.04 43.89,61.04 42.75,62.18 39.55,62.18 U$3.8 | v53.72,38.86 53.72,38.18 55.09,36.8 55.09,33.38 59.21,29.26 59.66,29.26 U$1.21
CLK8
  Top 0.254: U$1.22 61.49,29.95 61.49,23.09 60.58,22.17 60.58,13.26 62.18,11.66 62.18,6.4 JP1.15
CLRN  (via drill 0.61)
  Top 0.254: v29.03,54.41 27.2,54.41 IC1.9 | v29.26,43.66 30.18,42.75 30.86,42.75 IC13.14 | v39.78,36.8 39.78,37.26 40.69,38.18 45.03,38.18 45.49,38.63 46.86,38.63 IC10.19
  Bottom 0.254: v29.03,54.41 29.03,52.58 30.4,51.21 30.4,45.49 | 30.4,45.49 30.4,44.81 v29.26,43.66 | v39.78,36.8 38.41,36.8 35.2,40.01 35.2,44.81 34.52,45.49 30.4,45.49
COMP
  Top 0.254: 93.95,71.32 91.21,71.32 90.3,72.24 L1.2 | 93.95,71.32 93.95,76.12 JP2.4 | 93.95,71.32 C4.1
CSAH  (via drill 0.61)
  Top 0.254: IC1.4 20.34,57.15 16.92,60.58 v16.92,60.81 | v14.86,50.52 v16.92,52.58 | v20.34,37.03 23.77,33.6 23.77,29.03 25.38,27.43 IC7.11
  Bottom 0.254: v16.92,52.58 v16.92,60.81 | v14.86,50.52 14.86,42.52 v20.34,37.03
CSAHN
  Top 0.254: IC13.13 30.86,41.38 29.03,41.38 28.12,42.29 28.12,51.44 30.4,53.72 30.4,59.66 28.35,61.72 24.92,61.72 21.72,58.52 21.26,58.52 IC1.3
D0  (via drill 0.61)
  Top 0.254: IC7.2 36.12,17.14 36.8,17.83 | 36.8,17.83 39.09,20.12 39.09,24.23 40.01,25.15 40.01,29.03 38.86,30.18 38.86,37.26 42.06,40.46 | 42.06,40.46 42.29,40.69 45.72,40.69 46.41,40.01 IC10.18 | 36.8,17.83 v37.26,17.37 | v35.2,53.95 36.12,54.86 37.03,54.86 44.35,62.18 U$1.7 | 42.06,40.46 v41.83,40.69
  Bottom 0.254: v37.26,17.37 41.83,12.8 41.83,6.4 JP1.31 | v35.2,53.95 35.2,53.26 41.83,46.63 v41.83,40.69
D1  (via drill 0.61)
  Top 0.254: IC7.3 35.43,18.29 34.75,18.29 34.06,17.6 34.06,14.86 v34.52,14.4 39.32,9.6 39.32,6.4 JP1.33 | v48.92,42.29 48.01,41.38 47.09,41.38 IC10.17 | v42.52,63.32 42.98,63.32 44.35,64.69 U$1.6 | v14.4,22.17 14.4,23.55 v2.74,35.2 | v7.54,70.41 16,70.41 17.6,72.01 19.66,72.01 24.92,77.27 28.35,77.27 29.95,75.67 29.95,74.52 31.09,73.38 32.92,73.38 34.52,71.78 34.52,65.84 36.8,63.55 v37.03,63.55
  Bottom 0.254: v48.92,42.29 48.92,46.86 45.03,50.75 44.12,50.75 36.58,58.29 36.58,61.72 37.72,62.87 | 37.72,62.87 38.18,63.32 v42.52,63.32 | v34.52,14.4 32.69,14.4 24.92,22.17 v14.4,22.17 | v2.74,35.2 2.74,64.47 7.54,69.27 v7.54,70.41 | 37.72,62.87 v37.03,63.55
D2  (via drill 0.61)
  Top 0.254: IC7.4 35.43,19.66 34.75,19.66 33.6,18.52 33.6,9.14 36.35,6.4 36.8,6.4 JP1.35 | IC10.16 47.09,42.75 48.01,42.75 49.38,44.12 49.38,52.58 48.46,53.49 48.46,67.67 48.69,67.89 48.69,68.81 48.23,69.27 46.63,69.27 44.58,67.21 U$1.5 | v30.4,15.09 30.4,22.63 v28.57,24.46 | v13.95,52.58 13.95,63.32 17.14,66.52 v23.32,66.52
  Bottom 0.254: v30.4,15.09 36.8,8.69 36.8,6.4 JP1.35 | v28.57,24.46 27.2,24.46 21.26,30.4 20.34,30.4 13.95,36.8 v13.95,52.58 | v23.32,66.52 26.06,63.78 33.15,63.78 35.66,66.29 43.43,66.29 U$1.5
D3  (via drill 0.61)
  Top 0.254: JP1.37 34.29,6.4 32.69,8 32.69,20.12 33.38,20.8 35.43,20.8 IC7.5 35.66,21.03 36.35,21.03 37.49,22.17 37.49,30.18 37.03,30.63 37.03,37.26 42.98,43.2 v43.43,43.2 44.81,43.2 45.26,43.66 46.86,43.66 IC10.15 | v49.61,65.15 49.61,57.84 v49.38,57.61
  Bottom 0.254: U$1.4 45.26,69.04 45.26,68.81 48.92,65.15 v49.61,65.15 | v49.38,57.61 49.84,57.61 52.12,55.32 52.12,44.35 50.75,42.98 50.75,42.29 49.38,40.92 47.09,40.92 44.81,43.2 v43.43,43.2
D4  (via drill 0.61)
  Top 0.254: JP1.39 31.77,6.4 31.77,19.89 34.06,22.17 35.43,22.17 IC7.6 35.66,22.4 36.35,22.4 37.03,23.09 37.03,29.95 36.58,30.4 36.58,37.49 37.49,38.41 v37.49,39.09 | v38.41,41.38 42.75,45.72 44.81,45.72 45.26,45.26 46.86,45.26 IC10.14 47.09,45.26 47.78,45.26 48.92,46.41 48.92,50.52 v46.18,53.26 | v41.38,61.27 41.6,61.49 41.6,68.81 44.35,71.55 44.35,72.24 U$1.3
  Bottom 0.254: v38.41,41.38 38.41,40.01 v37.49,39.09 | v41.38,61.27 41.38,58.52 44.12,55.78 45.03,55.78 46.18,54.63 v46.18,53.26
D5  (via drill 0.61)
  Top 0.254: 32.69,22.17 31.32,20.8 31.32,12.34 28.12,9.14 28.12,4.8 29.03,3.89 JP1.41 | 32.69,22.17 33.83,23.32 35.43,23.32 IC7.7 | v47.55,50.52 48.46,49.61 48.46,47.09 47.78,46.41 47.09,46.41 IC10.13 | v47.55,53.26 46.63,54.18 45.72,54.18 44.81,53.26 36.8,53.26 34.29,50.75 v34.29,43.66 | v25.38,33.83 25.38,32 24.23,30.86 24.23,30.18 26.29,28.12 26.75,28.12 32.69,22.17 | v26.52,64.69 26.52,64.24 30.86,59.89 30.86,49.84 v29.49,48.46
  Bottom 0.254: v47.55,53.26 v47.55,50.52 | v25.38,33.83 34.29,42.75 v34.29,43.66 32.46,43.66 31.55,42.75 28.8,42.75 28.35,43.2 28.35,44.12 29.95,45.72 29.95,47.55 29.49,48.01 v29.49,48.46 | v26.52,64.69 25.38,65.84 25.38,68.81 29.95,73.38 41.83,73.38 43.2,74.75 44.35,74.75 U$1.2
D6  (via drill 0.61)
  Top 0.254: v33.15,24.46 33.38,24.69 35.43,24.69 IC7.8 | v36.35,11.2 36.35,8.69 v35.89,8.23 | v42.52,49.84 43.89,48.46 | 43.89,48.46 44.12,48.23 44.81,48.23 45.26,47.78 46.86,47.78 IC10.12 | v36.8,64.92 36.8,68.58 34.98,70.41 34.98,71.32 37.49,73.84 40.46,73.84 41.6,74.98 v41.6,75.21 | v22.86,33.15 v22.86,26.75 | v32.92,42.75 38.18,42.75 43.89,48.46
  Bottom 0.254: v36.35,11.2 35.89,11.66 35.89,21.72 v33.15,24.46 30.63,24.46 29.26,23.09 26.52,23.09 v22.86,26.75 | v35.89,8.23 35.89,7.09 35.66,6.86 35.66,5.94 36.58,5.03 37.26,5.03 37.95,4.34 37.95,3.2 37.26,2.52 27.89,2.52 26.75,3.66 JP1.43 | v42.52,49.84 42.52,51.66 36.12,58.06 36.12,64.24 v36.8,64.92 | v41.6,75.21 42.29,75.21 44.35,77.27 U$1.1 | v22.86,33.15 23.32,33.15 v32.92,42.75
D7  (via drill 0.61)  (1 unrouted)
  Top 0.254: v31.32,25.83 35.43,25.83 IC7.9 | v35.66,50.75 45.03,50.75 46.86,48.92 IC10.11 | v14.86,55.32 v19.2,55.32
  Bottom 0.254: v31.32,25.83 29.03,23.55 27.43,23.55 23.32,27.66 18.52,27.66 | 18.52,27.66 12.8,21.95 12.8,13.49 18.75,7.54 19.43,7.54 20.34,6.63 20.34,5.94 21.26,5.03 22.86,5.03 24,3.89 JP1.45 | v35.66,50.75 35.2,50.75 30.63,55.32 v19.2,55.32 | v14.86,55.32 11.2,58.98 9.83,58.98 9.37,58.52 9.37,56.24 11.2,54.41 11.2,37.95 18.52,30.63 18.52,27.66
D8  (via drill 0.61)
  Top 0.254: v66.52,33.6 64.24,33.6 63.78,34.06 63.78,34.98 62.87,35.89 61.95,35.89 61.72,35.66 59.44,35.66 58.98,35.2 53.26,35.2 52.81,35.66 52.81,36.58 54.86,38.63 56.92,38.63 IC10.2 | v73.38,43.66 78.64,43.66 80.47,41.83 85.95,41.83 v88.01,39.78 | v85.27,29.03 v88.01,31.77 | v88.01,49.38 v80.7,56.69
  Bottom 0.254: v66.52,33.6 66.52,34.29 73.38,41.15 v73.38,43.66 | v88.01,31.77 v88.01,39.78 v88.01,49.38 | v85.27,29.03 81.84,25.6 81.38,25.6 U$4.11 | v80.7,56.69 70.87,56.69 70.18,56.01 69.49,56.01 68.81,56.69 68.81,58.75 70.87,60.81 70.87,69.72 68.12,72.47 59.89,72.47 U$1.38
D9  (via drill 0.61)
  Top 0.254: IC10.3 55.09,40.01 52.12,42.98 52.12,65.15 55.09,68.12 58.06,68.12 59.66,69.72 U$1.37 | v82.53,66.98 82.07,66.98 81.61,67.44 80.24,67.44 78.87,68.81 77.04,68.81 74.07,71.78 61.72,71.78 v61.49,71.55
  Bottom 0.254: U$4.12 82.75,22.86 88.92,29.03 88.92,60.58 v82.53,66.98 | v61.49,71.55 59.89,69.95 U$1.37
D10  (via drill 0.61)
  Top 0.254: IC10.4 56.92,41.38 54.41,41.38 52.58,43.2 52.58,64.92 54.86,67.21 59.66,67.21 U$1.36 59.89,67.44 61.27,68.81 74.3,68.81 77.72,65.38 81.84,65.38 82.3,65.84 86.87,65.84 88.92,63.78 90.07,63.78 92.58,61.27 92.58,55.32 v91.67,54.41 | v88.92,20.12 81.38,20.12 U$4.13
  Bottom 0.254: v88.92,20.12 88.92,23.55 91.67,26.29 v91.67,54.41
D11  (via drill 0.61)
  Top 0.254: IC10.5 56.92,42.75 56.01,42.75 53.95,44.81 53.95,56.92 58.52,61.49 58.52,63.55 59.66,64.69 U$1.35 | v74.75,54.86 74.75,54.41 79.55,49.61 82.3,49.61 91.44,40.46 91.44,38.41 95.33,34.52 97.16,34.52 98.75,32.92 98.75,20.34 96.7,18.29 96.7,17.83 U$4.15
  Bottom 0.254: v74.75,54.86 69.27,54.86 59.89,64.24 59.89,64.69 U$1.35
D12
  Top 0.254: IC10.6 56.92,43.89 55.55,43.89 54.41,45.03 54.41,49.38 54.86,49.84 58.06,49.84 58.52,49.38 58.52,48.92 59.21,48.23 60.12,48.23 61.95,46.41 61.95,45.26 64.47,42.75 74.75,42.75 74.98,42.98 76.81,42.98 80.24,39.55 86.87,39.55 94.87,31.55 94.87,27.43 95.78,26.52 97.61,26.52 98.3,25.83 98.3,21.95 96.7,20.34 U$4.16
D13  (via drill 0.61)
  Top 0.254: v61.27,43.89 60.58,43.2 59.21,43.2 58.52,43.89 58.52,44.35 57.84,45.03 57.15,45.03 IC10.7 | v66.52,47.09 66.52,48.23 v69.27,50.98 | v78.64,46.41 v74.07,50.98 | v90.53,40.01 v85.27,45.26
  Bottom 0.254: v61.27,43.89 61.27,45.49 62.87,47.09 v66.52,47.09 | v69.27,50.98 70.41,50.98 70.64,51.21 73.84,51.21 v74.07,50.98 | v78.64,46.41 79.78,46.41 80.24,46.86 83.67,46.86 v85.27,45.26 | v90.53,40.01 90.53,25.83 87.55,22.86 87.55,20.12 87.1,19.66 87.1,18.75 87.55,18.29 91.9,18.29 96.47,22.86 U$4.17
D14
  Top 0.254: IC10.8 57.15,46.18 58.75,46.18 59.21,45.72 60.81,45.72 64.24,42.29 74.98,42.29 75.21,42.52 76.12,42.52 79.55,39.09 79.55,37.72 80.24,37.03 84.58,37.03 96.01,25.6 96.47,25.6 U$4.18
D15  (via drill 0.61)
  Top 0.254: v55.32,45.49 55.32,46.41 56.46,47.55 56.92,47.55 IC10.9 | v53.49,43.66 53.49,57.15 56.01,59.66 v56.01,60.35 | v76.81,53.72 80.92,53.72 86.64,48.01 88.47,48.01 94.64,41.83 v94.64,36.58
  Bottom 0.254: v53.49,43.66 v55.32,45.49 | v56.01,60.35 57.38,60.35 59.44,58.29 65.15,58.29 69.72,53.72 v76.81,53.72 | v94.64,36.58 94.64,32.69 95.78,31.55 97.61,31.55 98.3,30.86 98.3,29.72 U$4.19
GND  (via drill 0.61)
  Top 0.254: C3.2 69.95,62.18 73.84,62.18 76.12,59.89 C2.2 76.35,59.89 87.78,59.89 90.07,62.18 C9.2 90.3,62.18 91.44,61.04 C1.2 | v77.95,10.74 77.5,10.29 77.04,10.29 IC4.10 | v77.04,24.92 77.04,27.89 IC2.10 | JP1.3 77.5,6.4 77.5,8.23 80.01,10.74 80.01,16.46 81.15,17.6 U$4.14 81.38,17.83 88.01,17.83 90.3,20.12 v90.3,20.57 | C4.2 90.53,69.49 87.1,69.49 79.32,77.27 77.5,77.27 R3.1 | 24,39.78 24.23,40.01 IC13.5 24,39.78 | 24,39.78 23.32,39.09 23.32,37.03 24,36.35 24.69,36.35 IC13.8 24.92,36.12 24.92,35.66 26.29,34.29 26.29,31.32 25.6,30.63 C5.2 25.6,30.4 28.57,27.43 35.43,27.43 IC7.10 | IC5.9 56.46,13.95 55.32,13.95 IC5.8 55.09,13.95 55.09,10.74 53.26,8.91 53.26,3.43 52.35,2.52 49.15,2.52 48.23,3.43 48.23,4.12 47.09,5.26 45.49,5.26 44.58,6.17 JP1.29 | IC5.9 56.69,13.95 57.61,13.95 IC5.10 57.84,13.95 59.66,12.12 59.66,6.4 JP1.17 | v56.69,15.77 56.69,14.17 IC5.9 | JP1.49 19.2,3.89 19.2,6.17 JP1.50 | 2.52,38.18 3.2,38.18 IC12.7 2.52,38.18 | 2.52,38.18 1.83,38.86 1.83,39.78 2.52,40.46 3.2,40.46 IC12.5 3.2,40.69 3.2,41.83 IC12.4 3.2,42.06 2.52,42.06 1.83,42.75 1.83,43.66 2.52,44.35 3.2,44.35 IC12.2 3.2,44.58 3.2,45.72 IC12.1 5.03,45.72 8.69,49.38 C13.2 8.91,49.61 8.91,54.63 C15.2 C14.2 11.43,62.41 12.12,62.41 17.14,67.44 26.75,67.44 28.57,69.27 | 2.52,38.18 1.83,37.49 1.83,34.75 3.66,32.92 3.66,22.86 C6.2 | v55.32,48.92 56.92,48.92 IC10.10 | 28.57,69.27 29.95,67.89 29.95,64.01 31.55,62.41 U$3.7 | 28.57,69.27 26.75,71.09 26.75,72.24 C11.2 | IC12.12 9.37,43.2 9.37,44.35 IC12.13 9.6,44.58 12.34,44.58 17.83,50.06 | IC1.13 27.2,59.66 26.52,59.66 25.83,58.98 25.83,57.38 21.95,53.49 21.26,53.49 IC1.7 21.03,53.26 17.83,50.06
  Top 0.254: JP3.2 5.26,76.35 7.54,76.35 JP3.3 | v17.83,50.29 17.83,50.06 | v23.09,40.69 24,39.78
  Bottom 0.254: C10.2 73.84,47.09 74.3,47.09 80.47,53.26 85.95,53.26 88.01,55.32 88.01,60.81 85.5,63.32 84.58,63.32 83.67,62.41 83.67,56.69 83.21,56.24 82.3,56.24 81.61,56.92 81.61,57.15 79.1,59.66 76.35,59.66 C2.2 | v77.95,10.74 77.27,11.43 77.27,13.26 79.78,15.77 | 79.78,15.77 81.15,17.14 81.15,17.6 U$4.14 | v77.04,24.92 77.04,18.52 79.78,15.77 | C9.2 90.3,62.41 93.95,66.06 C4.2 | v90.3,20.57 90.3,24.23 92.58,26.52 92.58,54.86 91.44,56.01 C1.2 | v56.69,15.77 61.04,20.12 62.18,20.12 C8.2 | 40.69,21.95 40.69,23.09 41.83,24.23 | 40.69,21.95 40.69,21.72 C7.2 40.69,21.95 | 41.83,24.23 44.35,26.75 44.35,29.03 U$1.20 | 40.69,21.95 46.63,16 46.63,13.95 44.58,11.89 44.58,6.4 JP1.29 | 41.83,24.23 40.92,25.15 39.09,25.15 35.2,29.03 35.2,31.55 34.75,32 30.4,32 29.03,30.63 25.6,30.63 C5.2 | JP1.50 18.97,6.4 3.89,21.49 3.89,22.86 C6.2 | v55.32,48.92 55.32,53.03 47.09,61.27 | 47.09,61.27 44.81,63.55 43.66,63.55 41.38,65.84 35.89,65.84 32.46,62.41 31.77,62.41 U$3.7 | 22.17,45.95 22.63,46.41 22.63,50.75 23.77,51.89 24.46,51.89 25.38,50.98 29.03,50.98 C12.2 | 22.17,45.95 21.26,45.95 20.12,47.09 20.12,48.01 v17.83,50.29 11.43,56.69 C15.2 | JP3.3 7.77,76.12 7.77,74.3 9.83,72.24 9.83,64.01 11.43,62.41 C14.2 | v23.09,40.69 23.09,45.03 22.17,45.95 | 47.09,61.27 50.06,64.24 51.21,64.24 51.66,63.78 54.86,63.78 57.15,66.06 60.12,66.06 64.92,70.87 69.04,70.87 69.72,70.18 69.72,62.41 C3.2
  pour Bottom (isolate 0.406): 0,80.01 100.33,80.01 100.33,0 0,0
IOSELN  (1 unrouted)
IRQN  (via drill 0.61)
  Top 0.254: v54.63,8.91 55.78,7.77 55.78,3.43 56.69,2.52 62.64,2.52 63.32,3.2 63.32,4.12 64.24,5.03 65.15,5.03 66.06,4.12 66.06,3.43 67.44,2.06 69.72,2.06 71.09,3.43 71.09,4.12 72.24,5.26 72.24,6.17 JP1.7 | v50.98,32.23 49.84,33.38 v49.84,43.2
  Bottom 0.254: v54.63,8.91 54.18,8.91 51.44,11.66 51.44,18.75 52.35,19.66 52.35,23.77 49.38,26.75 49.38,27.89 51.21,29.72 51.21,32 v50.98,32.23 | v49.84,43.2 49.84,54.41 44.58,59.66 U$1.8
LUM
  Top 0.254: JP2.1 86.41,76.12 86.41,72.47 R4.1
  Bottom 0.254: C3.1 70.64,57.15 80.92,67.44 81.61,67.44 86.41,72.24 R4.1
N$2
  Top 0.254: D3.A 13.95,67.44 13.26,67.44 11.2,69.49 6.63,69.49 3.89,72.24 D2.C
N$5
  Top 0.254: IC12.9 9.37,39.55 8.69,39.55 6.63,41.6 6.63,46.18 8.91,48.46 14.17,48.46 20.12,54.41 21.03,54.41 IC1.6
N$6  (via drill 0.61)
  Top 0.254: v17.37,45.49 12.57,40.69 9.6,40.69 IC12.10 | v19.2,47.32 25.15,53.26 27.2,53.26 IC1.8
  Bottom 0.254: v19.2,47.32 v17.37,45.49
N$15
  Top 0.254: Q1.B 68.58,64.92 | 68.58,64.92 68.58,64.47 64.92,60.81 64.92,54.63 R1.1 | 68.58,64.92 76.12,64.92 C2.1
N$17
  Top 0.254: R2.1 85.5,68.58 89.15,64.92 90.07,64.92 L1.1
  Bottom 0.254: R2.1 78.64,68.58 77.5,69.72 R3.2
N$18
  Top 0.254: 81.38,61.04 82.3,61.04 86.18,64.92 R4.2 | 81.38,61.04 74.07,68.35 68.12,68.35 67.21,67.44 66.06,67.44 Q1.E | 81.38,61.04 R2.2
PH2  (via drill 0.61)
  Top 0.254: v74.3,8.46 71.32,8.46 71.09,8.23 63.78,8.23 v63.09,8.91 | v48.92,10.74 v53.72,10.74 | v46.86,29.49 46.86,34.29 44.35,36.8 U$1.17
  Bottom 0.254: v74.3,8.46 77.04,8.46 79.1,6.4 80.01,6.4 JP1.1 | v63.09,8.91 56.01,8.91 54.18,10.74 v53.72,10.74 | v48.92,10.74 48.01,11.66 48.01,24.46 46.86,25.6 v46.86,29.49
PU1  (via drill 0.61)
  Top 0.254: v65.38,26.06 65.38,27.89 IC2.1 | v72.01,43.66 74.98,46.63 v75.21,46.63 | v83.67,52.35 87.55,48.46 93.73,48.46 96.47,45.72 U$4.26 96.7,45.72 98.3,47.32 98.3,64.69 93.04,69.95 87.33,69.95 78.64,78.64 46.63,78.64 | v41.38,77.95 42.75,77.95 43.43,78.64 46.63,78.64 | v47.78,68.35 48.01,68.12 48.01,61.49 44.58,58.06 44.58,57.15 U$1.9 | 46.63,78.64 v46.63,77.72
  Bottom 0.254: v65.38,26.06 65.38,30.4 65.15,30.63 65.15,33.6 72.01,40.46 v72.01,43.66 | v75.21,46.63 79.55,50.98 79.55,51.21 80.7,52.35 v83.67,52.35 | v41.38,77.95 40.69,78.64 7.54,78.64 6.4,77.5 6.4,74.98 8.46,72.92 8.46,56.46 10.06,54.86 10.06,38.41 13.95,34.52 13.95,25.6 R5.1 | v47.78,68.35 47.78,71.55 49.84,73.61 49.84,74.52 v46.63,77.72
RASN  (via drill 0.61)
  Top 0.254: 77.27,20.12 79.32,20.12 80.24,19.2 v88.01,19.2 | 77.27,20.12 77.04,20.12 IC4.11 | v71.78,12.12 72.69,13.03 72.69,15.77 v72.47,16 | v74.52,18.06 75.21,18.06 77.27,20.12 | v41.15,37.26 42.06,37.26 44.35,34.98 44.35,34.29 U$1.18 | v29.26,36.35 29.26,39.09 v28.57,39.78 | v21.03,34.98 19.2,34.98 v18.75,35.43 | v11.89,33.6 v15.32,37.03 | v11.89,14.86 11.89,9.37 18.75,2.52 v19.89,2.52
  Bottom 0.254: v88.01,19.2 90.3,19.2 94.87,23.77 94.87,28.8 96.47,30.4 U$4.20 | 56.01,3.2 56.01,4.12 54.63,5.49 54.63,6.17 JP1.21 | 56.01,3.2 56.69,2.52 62.64,2.52 63.55,3.43 63.55,4.34 64.47,5.26 65.38,5.26 66.06,5.94 66.06,6.86 71.32,12.12 v71.78,12.12 | v74.52,18.06 v72.47,16 | v41.15,37.26 41.15,36.8 40.23,35.89 29.72,35.89 v29.26,36.35 | v28.57,39.78 25.83,39.78 v21.03,34.98 | v18.75,35.43 16.92,35.43 v15.32,37.03 | v11.89,14.86 v11.89,33.6 | v19.89,2.52 20.57,2.52 21.95,1.14 53.95,1.14 56.01,3.2
RCLRN  (1 unrouted)
RDY  (via drill 0.61)
  Top 0.254: v45.26,13.95 45.26,13.03 48.46,9.83 48.92,9.83 51.89,6.86 51.89,6.4 JP1.23 | v34.29,31.09 34.29,37.26 37.49,40.46 38.86,40.46 v42.75,44.35
  Bottom 0.254: v45.26,13.95 46.18,14.86 46.18,15.77 41.38,20.57 39.32,20.57 32.23,27.66 32.23,29.03 v34.29,31.09 | v42.75,44.35 44.12,45.72 44.81,45.72 45.72,46.63 45.72,48.23 44.58,49.38 U$1.12
RW  (via drill 0.61)
  Top 0.254: v75.44,23.77 75.44,27.89 IC2.9
  Bottom 0.254: v75.44,23.77 75.44,17.6 72.92,15.09 70.64,15.09 63.55,8 48.69,8 47.09,6.4 JP1.27
RWB  (via drill 0.61)
  Top 0.254: IC10.1 57.15,37.49 57.84,37.49 58.52,38.18 58.52,40.01 59.21,40.69 63.32,40.69 v64.01,41.38 64.47,41.83 73.61,41.83 76.81,38.63 76.81,38.18 IC2.11 | v17.6,65.61 16.92,65.61 15.54,64.24 15.54,60.81 20.34,56.01 21.03,56.01 IC1.5 | v37.49,59.89 37.49,61.72 37.03,62.18 | 37.03,62.18 33.6,65.61 33.6,70.18 32.46,71.32 30.63,71.32 28.12,73.84 28.12,76.12 R6.1 | v64.01,50.52 v64.01,45.03 | v54.18,59.21 54.18,63.78 55.09,64.69 v55.09,65.38 | v49.15,71.55 48.46,71.55 v46.41,73.61 | v42.29,72.01 42.29,70.18 41.15,69.04 41.15,64.47 40.01,63.32 38.18,63.32 37.03,62.18
  Bottom 0.254: v17.6,65.61 17.6,66.06 20.34,68.81 22.17,68.81 25.6,72.24 25.6,73.84 27.89,76.12 R6.1 | v37.49,59.89 44.35,53.03 44.35,52.12 U$1.11 | v64.01,45.03 v64.01,41.38 | v64.01,50.52 61.27,53.26 59.44,53.26 54.18,58.52 v54.18,59.21 | v55.09,65.38 49.15,71.32 v49.15,71.55 | v46.41,73.61 43.89,73.61 v42.29,72.01
VA0  (via drill 0.61)
  Top 0.254: 57.38,21.49 58.52,22.63 v58.52,33.15 | 57.38,21.49 54.63,18.75 53.49,18.75 50.98,16.23 49.15,16.23 47.78,14.86 47.78,14.17 IC5.2 | v66.75,14.4 66.75,10.29 IC4.2 | v58.29,20.8 57.61,21.49 57.38,21.49 | IC2.18 67.89,37.95 67.89,37.26 67.21,36.58 60.12,36.58 59.89,36.8 U$1.24
  Bottom 0.254: v58.52,33.15 58.52,35.66 U$1.24 | v66.75,14.4 66.75,17.37 66.29,17.83 66.29,18.97 63.32,21.95 59.44,21.95 v58.29,20.8
VA1  (via drill 0.61)
  Top 0.254: v48.92,12.12 48.92,13.95 IC5.3 | v50.29,30.18 54.41,34.29 v56.01,34.29 | v57.84,36.35 58.52,37.03 58.52,37.49 59.66,38.63 | 59.66,38.63 59.66,39.32 U$1.25 59.66,38.63 | v65.84,16.69 67.89,14.63 67.89,10.29 IC4.3 | v59.66,27.43 v59.66,20.8 | 59.66,38.63 60.35,37.95 61.72,37.95 63.55,39.78 64.47,39.78 65.38,40.69 67.21,40.69 69.04,38.86 69.04,38.18 IC2.17
  Bottom 0.254: v48.92,12.12 48.92,28.8 v50.29,30.18 | v57.84,36.35 57.84,36.12 v56.01,34.29 56.01,33.15 58.75,30.4 60.12,30.4 61.04,29.49 61.04,28.8 v59.66,27.43 | v65.84,16.69 65.84,18.75 63.09,21.49 60.35,21.49 v59.66,20.8
VA2  (via drill 0.61)
  Top 0.254: v69.04,15.77 69.04,10.29 IC4.4 | v53.95,17.83 53.26,17.83 50.29,14.86 50.29,14.17 IC5.4 | v64.47,35.66 68.81,35.66 70.41,37.26 70.41,37.95 IC2.16
  Bottom 0.254: v69.04,15.77 66.75,18.06 66.75,22.4 | 66.75,22.4 66.75,23.55 65.15,25.15 64.92,25.15 63.32,26.75 63.32,35.66 | 63.32,35.66 63.32,37.72 62.18,38.86 62.18,39.55 59.89,41.83 U$1.26 | v53.95,17.83 58.52,22.4 66.75,22.4 | 63.32,35.66 v64.47,35.66
VA3  (via drill 0.61)
  Top 0.254: IC5.5 51.44,13.03 v52.35,12.12 | v62.41,34.98 v62.41,25.6 62.41,23.32 61.04,21.95 61.04,19.89 62.18,18.75 v64.47,18.75 | v70.41,16 70.41,10.29 IC4.5 | v61.27,38.86 62.64,40.23 64.24,40.23 65.15,41.15 69.27,41.15 71.55,38.86 71.55,38.18 IC2.15
  Bottom 0.254: v52.35,12.12 52.35,18.97 53.26,19.89 53.26,20.12 58.75,25.6 v62.41,25.6 | v62.41,34.98 62.41,37.72 v61.27,38.86 61.04,39.09 61.04,39.78 60.12,40.69 59.21,40.69 58.52,41.38 58.52,43.2 59.66,44.35 U$1.27 | v70.41,16 69.95,15.54 69.95,15.32 68.12,13.49 66.29,13.49 64.47,15.32 v64.47,18.75
VA4  (via drill 0.61)
  Top 0.254: v61.27,11.2 60.12,12.34 60.12,13.72 57.15,16.69 54.63,16.69 52.81,14.86 52.81,14.17 IC5.6 | v63.09,10.29 64.69,8.69 70.87,8.69 71.55,9.37 71.55,10.06 IC4.6 | v68.12,33.15 71.78,33.15 72.01,33.38 74.07,33.38 74.52,33.83 74.52,34.75 73.15,36.12 73.15,37.95 IC2.14 | v63.55,19.66 63.55,28.57 v66.06,31.09
  Bottom 0.254: 62.18,11.2 v61.27,11.2 | v63.09,10.29 62.18,11.2 | U$1.28 59.89,47.09 61.27,48.46 69.95,48.46 74.3,44.12 74.3,41.38 68.12,35.2 v68.12,33.15 v66.06,31.09 | 62.18,11.2 62.18,12.34 63.55,13.72 v63.55,19.66
VA5  (via drill 0.61)
  Top 0.254: v73.61,13.26 73.15,12.8 73.15,10.29 IC4.7 | v77.95,19.2 v77.95,16.23 | v75.44,36.12 74.3,37.26 IC2.13 | v54.18,12.12 54.18,13.95 IC5.7 | v62.18,13.72 64.92,16.46 64.92,17.14 66.29,18.52 v67.67,18.52 | v69.04,34.06 69.72,34.06 70.18,33.6 71.55,33.6 72.24,34.29 v73.61,34.29 | v72.24,47.55 v69.95,49.84
  Bottom 0.254: v73.61,13.26 74.52,13.26 77.5,16.23 v77.95,16.23 | v77.95,19.2 77.95,22.17 78.41,22.63 78.41,31.32 75.44,34.29 | v75.44,36.12 75.44,34.29 | v54.18,12.12 60.58,12.12 v62.18,13.72 | v67.67,18.52 67.67,26.52 71.09,29.95 71.09,32 v69.04,34.06 69.04,35.2 70.18,36.35 70.64,36.35 74.75,40.46 74.75,44.35 72.24,46.86 v72.24,47.55 | 75.44,34.29 v73.61,34.29 | v69.95,49.84 69.49,49.38 59.89,49.38 U$1.29
VA6  (via drill 0.61)
  Top 0.254: IC4.8 74.3,12.57 74.52,12.8 74.52,15.32 72.69,17.14 v71.78,17.14 | v76.81,40.01 77.5,39.32 77.5,36.8 77.27,36.58 76.35,36.58 75.67,37.26 75.67,37.95 IC2.12 75.44,38.18 75.44,38.86 73.38,40.92 v71.09,40.92 | v62.87,45.72 62.87,48.01 59.89,50.98 59.89,51.89 U$1.30
  Bottom 0.254: v71.78,17.14 71.78,24.23 72.24,24.69 72.24,35.43 v76.81,40.01 | v62.87,45.72 62.87,38.86 63.78,37.95 68.12,37.95 v71.09,40.92
VA7  (via drill 0.61)
  Top 0.254: v78.18,12.12 76.81,12.12 75.67,10.97 75.67,10.29 IC4.9 | v89.84,49.38 89.38,49.38 82.53,56.24 82.3,56.24 81.61,56.92 81.61,57.15 80.7,58.06 73.38,58.06 71.55,59.89 70.64,59.89 66.98,56.24 66.98,52.58 66.52,52.12 62.41,52.12 59.89,54.63 U$1.31
  Bottom 0.254: v78.18,12.12 78.18,12.57 84.35,18.75 84.35,23.77 89.61,29.03 89.61,49.15 v89.84,49.38
VCC  (via drill 0.61)  (3 unrouted)
  Top 0.254: C8.1 62.41,15.32 65.38,18.29 65.38,20.12 IC4.20 65.38,20.34 v65.38,23.55 | v64.24,38.86 64.92,38.18 65.38,38.18 IC2.20 | v29.03,47.09 30.86,45.26 IC13.16 | IC1.14 27.2,60.81 28.12,60.81 29.95,58.98 29.95,53.95 26.98,50.98 24.23,50.98 C12.1 24,50.75 23.55,50.75 20.12,47.32 20.12,40.46 15.32,35.66 15.32,18.97 14.17,17.83 R5.2 13.95,17.83 3.89,17.83 | IC5.20 46.18,24 46.18,22.17 40.69,16.69 C7.1 | v46.18,36.35 46.18,36.58 46.86,37.26 IC10.20 | v20.57,16 25.38,16 IC7.20 | C14.1 6.17,62.41 6.17,64.92 3.89,67.21 D3.C | v7.54,45.72 IC12.14 | R6.2 20.12,76.35 12.34,76.35 10.52,78.18 2.06,78.18 1.37,77.5 1.37,51.89 3.66,49.61 C13.1 | v56.01,36.35 53.95,36.35 v53.72,36.12
  Bottom 0.254: v64.24,38.86 64.24,40.23 65.61,41.6 65.61,44.12 68.35,46.86 | 68.35,46.86 68.58,47.09 C10.1 68.35,46.86 | 59.21,45.72 58.52,46.41 58.52,47.55 59.21,48.23 60.12,48.23 60.81,48.92 73.38,48.92 78.18,53.72 85.72,53.72 87.55,55.55 87.55,56.24 85.27,58.52 85.27,62.18 C9.1 | 59.21,45.72 60.81,45.72 63.09,48.01 67.21,48.01 68.35,46.86 | v65.38,23.55 65.38,24 61.49,27.89 61.49,36.8 60.12,38.18 59.21,38.18 58.52,38.86 | 58.52,38.86 58.06,39.32 58.06,44.58 59.21,45.72 | 27.89,47.09 v29.03,47.09 | 27.89,47.09 24.23,50.75 C12.1 | v46.18,36.35 45.72,36.35 44.81,35.43 43.2,35.43 | 43.2,35.43 42.52,35.43 39.55,32.46 25.83,32.46 24.23,30.86 | 24.23,30.86 24.23,30.18 24.92,29.49 29.49,29.49 40.46,18.52 40.46,16.69 C7.1 | 27.89,47.09 27.89,43.2 20.12,35.43 20.12,32.23 21.49,30.86 24.23,30.86 | v20.57,16 15.77,16 14.17,17.6 R5.2 | C11.1 21.49,72.47 21.49,74.98 20.34,76.12 R6.2 | C14.1 6.17,62.18 6.17,58.52 3.89,56.24 3.89,49.61 C13.1 3.89,49.38 v7.54,45.72 6.63,44.81 6.63,37.72 2.74,33.83 2.74,21.95 3.66,21.03 3.66,17.83 | v56.01,36.35 58.52,38.86 | v53.72,36.12 49.38,36.12 44.81,40.69 44.12,40.69 43.2,39.78 43.2,35.43
VICCSN
  Top 0.254: IC13.15 31.09,43.89 31.77,43.89 33.38,45.49 33.38,50.75 37.03,54.41 44.35,54.41 U$1.10
VVID
  Bottom 0.254: Q1.C 68.58,69.72 67.44,68.58 67.44,67.21 64.92,64.69 64.92,62.41 R1.2 64.92,62.18 64.92,59.89 69.27,55.55 70.41,55.55 70.64,55.78 86.18,55.78 C1.1
WCLRN  (via drill 0.61)
  Top 0.254: IC1.11 26.52,57.15 25.83,56.46 25.83,56.24 18.29,48.69 18.29,45.03 11.43,38.18 9.6,38.18 IC12.8 9.37,38.18 8.69,38.18 v7.54,39.32 | v82.75,57.15 87.55,52.35 90.53,52.35 94.41,48.46 96.47,48.46 U$4.27 | v81.38,66.29 80.7,66.29 78.64,68.35 76.81,68.35 73.84,71.32 65.38,71.32 64.69,70.64 60.58,70.64 60.12,71.09 57.15,71.09 53.26,74.98 v46.18,74.98 | v26.98,73.84 24.46,73.84 19.89,69.27 17.6,69.27 14.4,66.06 13.03,66.06 7.54,60.58 7.54,49.61 v6.4,48.46
  Bottom 0.254: v82.75,57.15 82.75,64.92 v81.38,66.29 | v46.18,74.98 45.03,76.12 43.89,76.12 41.6,73.84 v26.98,73.84 | v6.4,48.46 8.46,46.41 8.46,40.23 v7.54,39.32